# Altium schematic sheet MINI_BLDC_DRV_POWER.SchDoc
size A4
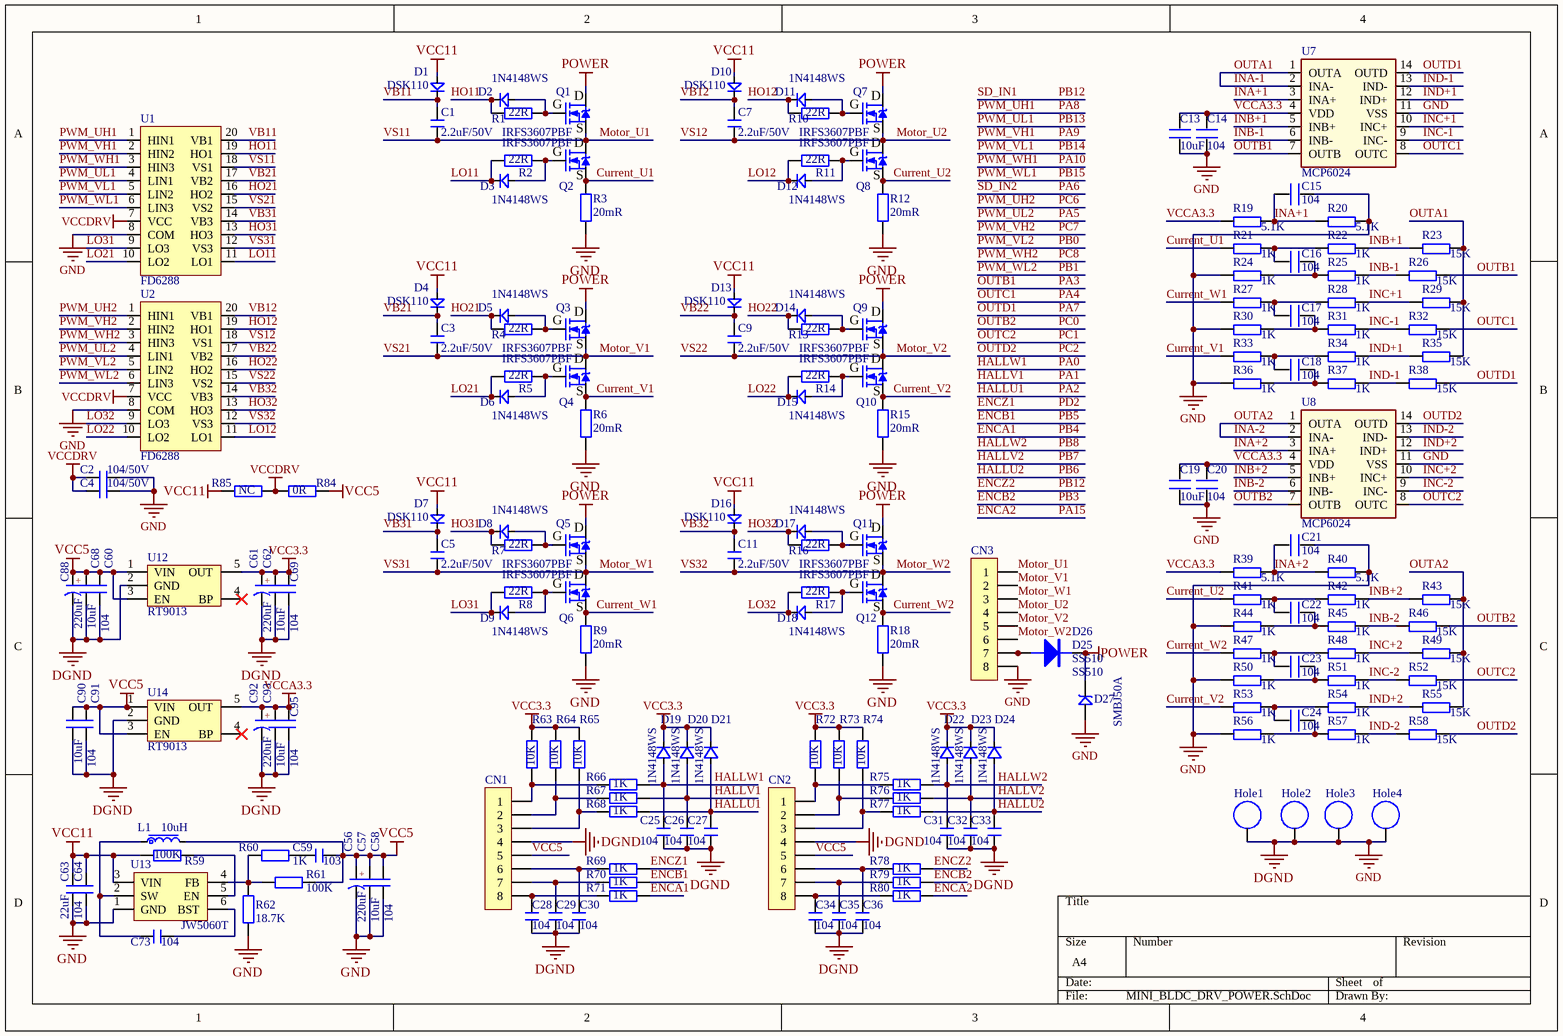
[diagram p0: MINI_BLDC_DRV_POWER.SchDoc]

## Parts
C1  2.2uF/50V  [C 0603_L]
C2  104/50V  [C 0603_L]
C3  2.2uF/50V  [C 0603_L]
C4  104/50V  [C 0603_L]
C5  2.2uF/50V  [C 0603_L]
C7  2.2uF/50V  [C 0603_L]
C9  2.2uF/50V  [C 0603_L]
C11  2.2uF/50V  [C 0603_L]
C13  10uF  [C 0603_L]
C14  104  [C 0603_L]
C15  104  [C 0603_L]
C16  104  [C 0603_L]
C17  104  [C 0603_L]
C18  104  [C 0603_L]
C19  10uF  [C 0603_L]
C20  104  [C 0603_L]
C21  104  [C 0603_L]
C22  104  [C 0603_L]
C23  104  [C 0603_L]
C24  104  [C 0603_L]
C25  104  [C 0603_L]
C26  104  [C 0603_L]
C27  104  [C 0603_L]
C28  104  [C 0603_L]
C29  104  [C 0603_L]
C30  104  [C 0603_L]
C31  104  [C 0603_L]
C32  104  [C 0603_L]
C33  104  [C 0603_L]
C34  104  [C 0603_L]
C35  104  [C 0603_L]
C36  104  [C 0603_L]
C56  220uF  [CM D(6.3*5.4)]
C57  10uF  [C 0603_L]
C58  104  [C 0603_L]
C59  103  [C 0603_L]
C60  104  [C 0603_L]
C61  220uF  [CM D(6.3*5.4)]
C62  10uF  [C 0603_L]
C63  22uF  [C 0805_L]
C64  104  [C 0603_L]
C68  10uF  [C 0603_L]
C69  104  [C 0603_L]
C73  104  [C 0603_L]
C88  220uF  [CM D(6.3*5.4)]
C90  10uF  [C 0603_L]
C91  104  [C 0603_L]
C92  220uF  [CM D(6.3*5.4)]
C93  10uF  [C 0603_L]
C95  104  [C 0603_L]
CN1  HDR-1X8  [SH1.0 S-W-8P]  (value not drawn)
CN2  HDR-1X8  [SH1.0 S-W-8P]  (value not drawn)
CN3  HDR-1X8  [KF7620-8P]  (value not drawn)
D1  DSK110  [SOD-123F]
D2  1N4148WS  [SOD-323]
D3  1N4148WS  [SOD-323]
D4  DSK110  [SOD-123F]
D5  1N4148WS  [SOD-323]
D6  1N4148WS  [SOD-323]
D7  DSK110  [SOD-123F]
D8  1N4148WS  [SOD-323]
D9  1N4148WS  [SOD-323]
D10  DSK110  [SOD-123F]
D11  1N4148WS  [SOD-323]
D12  1N4148WS  [SOD-323]
D13  DSK110  [SOD-123F]
D14  1N4148WS  [SOD-323]
D15  1N4148WS  [SOD-323]
D16  DSK110  [SOD-123F]
D17  1N4148WS  [SOD-323]
D18  1N4148WS  [SOD-323]
D19  1N4148WS  [SOD-323]
D20  1N4148WS  [SOD-323]
D21  1N4148WS  [SOD-323]
D22  1N4148WS  [SOD-323]
D23  1N4148WS  [SOD-323]
D24  1N4148WS  [SOD-323]
D25  SS510  [SMB]
D26  SS510  [SMB]
D27  SMBJ50A  [SMC]
Hole1  M3孔  [M3x4_L]  (value not drawn)
Hole2  M3孔  [M3x4_L]  (value not drawn)
Hole3  M3孔  [M3x4_L]  (value not drawn)
Hole4  M3孔  [M3x4_L]  (value not drawn)
L1  10uH  [L-SMD-0420]
Q1  IRFS3607PBF  [TO263_3B]
Q2  IRFS3607PBF  [TO263_3B]
Q3  IRFS3607PBF  [TO263_3B]
Q4  IRFS3607PBF  [TO263_3B]
Q5  IRFS3607PBF  [TO263_3B]
Q6  IRFS3607PBF  [TO263_3B]
Q7  IRFS3607PBF  [TO263_3B]
Q8  IRFS3607PBF  [TO263_3B]
Q9  IRFS3607PBF  [TO263_3B]
Q10  IRFS3607PBF  [TO263_3B]
Q11  IRFS3607PBF  [TO263_3B]
Q12  IRFS3607PBF  [TO263_3B]
R1  22R  [R 0603_L]
R2  22R  [R 0603_L]
R3  20mR  [R 2512_L]
R4  22R  [R 0603_L]
R5  22R  [R 0603_L]
R6  20mR  [R 2512_L]
R7  22R  [R 0603_L]
R8  22R  [R 0603_L]
R9  20mR  [R 2512_L]
R10  22R  [R 0603_L]
R11  22R  [R 0603_L]
R12  20mR  [R 2512_L]
R13  22R  [R 0603_L]
R14  22R  [R 0603_L]
R15  20mR  [R 2512_L]
R16  22R  [R 0603_L]
R17  22R  [R 0603_L]
R18  20mR  [R 2512_L]
R19  5.1K  [R 0603_L]
R20  5.1K  [R 0603_L]
R21  1K  [R 0603_L]
R22  1K  [R 0603_L]
R23  15K  [R 0603_L]
R24  1K  [R 0603_L]
R25  1K  [R 0603_L]
R26  15K  [R 0603_L]
R27  1K  [R 0603_L]
R28  1K  [R 0603_L]
R29  15K  [R 0603_L]
R30  1K  [R 0603_L]
R31  1K  [R 0603_L]
R32  15K  [R 0603_L]
R33  1K  [R 0603_L]
R34  1K  [R 0603_L]
R35  15K  [R 0603_L]
R36  1K  [R 0603_L]
R37  1K  [R 0603_L]
R38  15K  [R 0603_L]
R39  5.1K  [R 0603_L]
R40  5.1K  [R 0603_L]
R41  1K  [R 0603_L]
R42  1K  [R 0603_L]
R43  15K  [R 0603_L]
R44  1K  [R 0603_L]
R45  1K  [R 0603_L]
R46  15K  [R 0603_L]
R47  1K  [R 0603_L]
R48  1K  [R 0603_L]
R49  15K  [R 0603_L]
R50  1K  [R 0603_L]
R51  1K  [R 0603_L]
R52  15K  [R 0603_L]
R53  1K  [R 0603_L]
R54  1K  [R 0603_L]
R55  15K  [R 0603_L]
R56  1K  [R 0603_L]
R57  1K  [R 0603_L]
R58  15K  [R 0603_L]
R59  100K  [R 0603_L]
R60  1K  [R 0603_L]
R61  100K  [R 0603_L]
R62  18.7K  [R 0603_L]
R63  10K  [R 0603_L]
R64  10K  [R 0603_L]
R65  10K  [R 0603_L]
R66  1K  [R 0603_L]
R67  1K  [R 0603_L]
R68  1K  [R 0603_L]
R69  1K  [R 0603_L]
R70  1K  [R 0603_L]
R71  1K  [R 0603_L]
R72  10K  [R 0603_L]
R73  10K  [R 0603_L]
R74  10K  [R 0603_L]
R75  1K  [R 0603_L]
R76  1K  [R 0603_L]
R77  1K  [R 0603_L]
R78  1K  [R 0603_L]
R79  1K  [R 0603_L]
R80  1K  [R 0603_L]
R84  0R  [R 0603_L]
R85  NC  [R 0603_L]
U1  FD6288  [TSSOP20_L]
U2  FD6288  [TSSOP20_L]
U7  MCP6024  [SOP14_L]
U8  MCP6024  [SOP14_L]
U12  RT9013  [SOT23-5N]
U13  JW5060T  [SOT23-6L]
U14  RT9013  [SOT23-5N]

## Nets
GND: C2.1 C4.1 C13.1 C14.1 C15.2 C19.1 C20.1 C21.2 C25.2 C26.2 C27.2 C28.2 C29.2 C30.2 C31.2 C32.2 C33.2 C34.2 C35.2 C36.2 C56.2(K) C57.2 C58.2 C60.2 C61.2(K) C62.2 C63.2 C64.2 C68.2 C69.2 C88.2(K) C90.2 C91.2 C92.2(K) C93.2 C95.2 CN1.4 CN2.4 CN3.8 D27.1 Hole1.0(PAD) Hole2.0(PAD) Hole3.0(PAD) Hole4.0(PAD) R3.1 R6.1 R9.1 R12.1 R15.1 R18.1 R20.2 R24.1 R30.1 R36.1 R40.2 R44.1 R50.1 R56.1 R62.2 U1.8(COM) U2.8(COM) U7.11(VSS) U8.11(VSS) U12.2(GND) U13.1(GND) U14.2(GND)  [also labelled DGND]
POWER: D25.2(K) D26.2(K) D27.2 Q1.2(D) Q3.2(D) Q5.2(D) Q7.2(D) Q9.2(D) Q11.2(D)
VCC3.3: C61.1(A) C62.1 C69.1 D19.2(K) D20.2(K) D21.2(K) D22.2(K) D23.2(K) D24.2(K) R63.1 R64.1 R65.1 R72.1 R73.1 R74.1 U12.5(OUT)
VCC5: C56.1(A) C57.1 C58.1 C59.2 C60.1 C68.1 C88.1(A) C90.1 C91.1 CN1.5 CN2.5 L1.2 R61.2 R84.2 U12.1(VIN) U12.3(EN) U14.1(VIN) U14.3(EN)
VCC11: C63.1 C64.1 D1.1(A) D4.1(A) D7.1(A) D10.1(A) D13.1(A) D16.1(A) R59.1 R85.1 U13.3(VIN)
VCCA3.3: C13.2 C14.2 C19.2 C20.2 C92.1(A) C93.1 C95.1 R19.1 R39.1 U7.4(VDD) U8.4(VDD) U14.5(OUT)
VCCDRV: C2.2 C4.2 R84.1 R85.2 U1.7(VCC) U2.7(VCC)
Current_U1: Q2.3(S) R3.2 R21.1
Current_U2: Q8.3(S) R12.2 R41.1
Current_V1: Q4.3(S) R6.2 R33.1
Current_V2: Q10.3(S) R15.2 R53.1
Current_W1: Q6.3(S) R9.2 R27.1
Current_W2: Q12.3(S) R18.2 R47.1
ENCA1: R71.2  [also labelled PB4]
ENCA2: R80.2  [also labelled PA15]
ENCB1: R70.2  [also labelled PB5]
ENCB2: R79.2  [also labelled PB3]
ENCZ1: R69.2  [also labelled PD2]
ENCZ2: R78.2  [also labelled PB12, SD_IN1]
HALLU1: C27.1 D21.1(A) R68.2  [also labelled PA2]
HALLU2: C33.1 D24.1(A) R77.2  [also labelled PB6]
HALLV1: C26.1 D20.1(A) R67.2  [also labelled PA1]
HALLV2: C32.1 D23.1(A) R76.2  [also labelled PB7]
HALLW1: C25.1 D19.1(A) R66.2  [also labelled PA0]
HALLW2: C31.1 D22.1(A) R75.2  [also labelled PB8]
HO11: D2.2(K) R1.1 U1.19(HO1)
HO12: D11.2(K) R10.1 U2.19(HO1)
HO21: D5.2(K) R4.1 U1.16(HO2)
HO22: D14.2(K) R13.1 U2.16(HO2)
HO31: D8.2(K) R7.1 U1.13(HO3)
HO32: D17.2(K) R16.1 U2.13(HO3)
INA+1: C15.1 R19.2 R20.1 U7.3(INA+)
INA+2: C21.1 R39.2 R40.1 U8.3(INA+)
INA-1: R23.2 R29.2 R35.2 U7.1(OUTA) U7.2(INA-)  [also labelled OUTA1]
INA-2: R43.2 R49.2 R55.2 U8.1(OUTA) U8.2(INA-)  [also labelled OUTA2]
INB+1: R22.2 R23.1 U7.5(INB+)
INB+2: R42.2 R43.1 U8.5(INB+)
INB-1: R25.2 R26.1 U7.6(INB-)
INB-2: R45.2 R46.1 U8.6(INB-)
INC+1: R28.2 R29.1 U7.10(INC+)
INC+2: R48.2 R49.1 U8.10(INC+)
INC-1: R31.2 R32.1 U7.9(INC-)
INC-2: R51.2 R52.1 U8.9(INC-)
IND+1: R34.2 R35.1 U7.12(IND+)
IND+2: R54.2 R55.1 U8.12(IND+)
IND-1: R37.2 R38.1 U7.13(IND-)
IND-2: R57.2 R58.1 U8.13(IND-)
LO11: D3.2(K) R2.1 U1.11(LO1)
LO12: D12.2(K) R11.1 U2.11(LO1)
LO21: D6.2(K) R5.1 U1.10(LO2)
LO22: D15.2(K) R14.1 U2.10(LO2)
LO31: D9.2(K) R8.1 U1.9(LO3)
LO32: D18.2(K) R17.1 U2.9(LO3)
Motor_U1: C1.1 CN3.1 Q1.3(S) Q2.2(D) U1.18(VS1)  [also labelled VS11]
Motor_U2: C7.1 CN3.4 Q7.3(S) Q8.2(D) U2.18(VS1)  [also labelled VS12]
Motor_V1: C3.1 CN3.2 Q3.3(S) Q4.2(D) U1.15(VS2)  [also labelled VS21]
Motor_V2: C9.1 CN3.5 Q9.3(S) Q10.2(D) U2.15(VS2)  [also labelled VS22]
Motor_W1: C5.1 CN3.3 Q5.3(S) Q6.2(D) U1.12(VS3)  [also labelled VS31]
Motor_W2: C11.1 CN3.6 Q11.3(S) Q12.2(D) U2.12(VS3)  [also labelled VS32]
OUTB1: R26.2 U7.7(OUTB)  [also labelled PA3]
OUTB2: R46.2 U8.7(OUTB)  [also labelled PC0]
OUTC1: R32.2 U7.8(OUTC)  [also labelled PA4]
OUTC2: R52.2 U8.8(OUTC)  [also labelled PC1]
OUTD1: R38.2 U7.14(OUTD)  [also labelled PA7]
OUTD2: R58.2 U8.14(OUTD)  [also labelled PC2]
PA5: U2.4(LIN1)  [also labelled PWM_UL2]
PA8: U1.1(HIN1)  [also labelled PWM_UH1]
PA9: U1.2(HIN2)  [also labelled PWM_VH1]
PA10: U1.3(HIN3)  [also labelled PWM_WH1]
PB0: U2.5(LIN2)  [also labelled PWM_VL2]
PB1: U2.6(LIN3)  [also labelled PWM_WL2]
PB13: U1.4(LIN1)  [also labelled PWM_UL1]
PB14: U1.5(LIN2)  [also labelled PWM_VL1]
PB15: U1.6(LIN3)  [also labelled PWM_WL1]
PC6: U2.1(HIN1)  [also labelled PWM_UH2]
PC7: U2.2(HIN2)  [also labelled PWM_VH2]
PC8: U2.3(HIN3)  [also labelled PWM_WH2]
VB11: C1.2 D1.2(K) U1.20(VB1)
VB12: C7.2 D10.2(K) U2.20(VB1)
VB21: C3.2 D4.2(K) U1.17(VB2)
VB22: C9.2 D13.2(K) U2.17(VB2)
VB31: C5.2 D7.2(K) U1.14(VB3)
VB32: C11.2 D16.2(K) U2.14(VB3)
NetC16_1: C16.1 R21.2 R22.1
NetC16_2: C16.2 R24.2 R25.1
NetC17_1: C17.1 R27.2 R28.1
NetC17_2: C17.2 R30.2 R31.1
NetC18_1: C18.1 R33.2 R34.1
NetC18_2: C18.2 R36.2 R37.1
NetC22_1: C22.1 R41.2 R42.1
NetC22_2: C22.2 R44.2 R45.1
NetC23_1: C23.1 R47.2 R48.1
NetC23_2: C23.2 R50.2 R51.1
NetC24_1: C24.1 R53.2 R54.1
NetC24_2: C24.2 R56.2 R57.1
NetC28_1: C28.1 CN1.8 R71.1
NetC29_1: C29.1 CN1.7 R70.1
NetC30_1: C30.1 CN1.6 R69.1
NetC34_1: C34.1 CN2.8 R80.1
NetC35_1: C35.1 CN2.7 R79.1
NetC36_1: C36.1 CN2.6 R78.1
NetC59_1: C59.1 R60.2
NetC73_1: C73.1 U13.6(BST)
NetC73_2: C73.2 L1.1 U13.2(SW)
NetCN1_1: CN1.1 R63.2 R66.1
NetCN1_2: CN1.2 R64.2 R67.1
NetCN1_3: CN1.3 R65.2 R68.1
NetCN2_1: CN2.1 R72.2 R75.1
NetCN2_2: CN2.2 R73.2 R76.1
NetCN2_3: CN2.3 R74.2 R77.1
NetCN3_7: CN3.7 D25.1(A) D26.1(A)
NetD2_1: D2.1(A) Q1.1(G) R1.2
NetD3_1: D3.1(A) Q2.1(G) R2.2
NetD5_1: D5.1(A) Q3.1(G) R4.2
NetD6_1: D6.1(A) Q4.1(G) R5.2
NetD8_1: D8.1(A) Q5.1(G) R7.2
NetD9_1: D9.1(A) Q6.1(G) R8.2
NetD11_1: D11.1(A) Q7.1(G) R10.2
NetD12_1: D12.1(A) Q8.1(G) R11.2
NetD14_1: D14.1(A) Q9.1(G) R13.2
NetD15_1: D15.1(A) Q10.1(G) R14.2
NetD17_1: D17.1(A) Q11.1(G) R16.2
NetD18_1: D18.1(A) Q12.1(G) R17.2
NetR59_2: R59.2 U13.5(EN)
NetR60_1: R60.1 R61.1 R62.1 U13.4(FB)

Not connected (* = marked no-connect by the designer): U12 4(BP)*; U14 4(BP)*

## Notes on the sheet
- (in symbol C-CM) +

## Library data of the parts
C1-C5 C7 C9 C11 C25-C36 C57-C60 C62-C64 C68 C69 C73 C90 C91 C93 C95 = C: 无极性贴片电容; 版权归属: 源创客; BOM名称: 无极性贴片电容; 学习资源: www.ooocke.com
C13-C24 = C
C56 C61 C88 C92 = C-CM: 贴片电解电容; 版权归属: 源创客; BOM名称: 贴片电解电容; 学习资源: www.ooocke.com
CN1-CN3 = Header 8: 8P接插件; 版权归属: 源创客; BOM名称: 8P接插件; 学习资源: www.ooocke.com
D1 D4 D7 D10 D13 D16 = DSK110: 通用二极管 100V-1A; BOM名称: 快恢复二极管; 版权归属: 源创客; 属性: 700V/1A
D2 D3 D5 D6 D8 D9 D11 D12 D14 D15 D17 D18 = FR107: 通用二极管 700V-1A; BOM名称: 快恢复二极管; 版权归属: 源创客; 属性: 700V/1A
D19-D24 = RS1M: 通用二极管 1000V-1A; BOM名称: 肖特基二极管; 版权归属: 源创客; 属性: 40V/1A; 学习资源: www.ooocke.com
D25 D26 = DIODE: 整流二极管
D27 = SMBJ: TVS
Hole1-Hole4 = M3: 铜柱孔; 版权归属: 源创客; BOM名称: 铜柱孔; 学习资源: www.ooocke.com
L1 = L-CDRH: 功率屏蔽电感; 版权归属: 源创客; BOM名称: 功率屏蔽电感; 学习资源: www.ooocke.com
Q1-Q12 = IRFS3607PBF: NMOS 75V+80A 7.4mΩ; BOM名称: N沟场效应管; 版权归属: 源创客; 学习资源: www.ooocke.com
R1-R18 R59-R80 R84 R85 = R: 贴片电阻; 版权归属: 源创客; BOM名称: 贴片电阻; 学习资源: www.ooocke.com
R19-R58 = R
U12 U14 = LDO RT9193: LDO; BOM名称: 稳压芯片; 版权归属: 源创客; 学习资源: www.ooocke.com
U13 = DC JW5060T_6: DC降压芯片